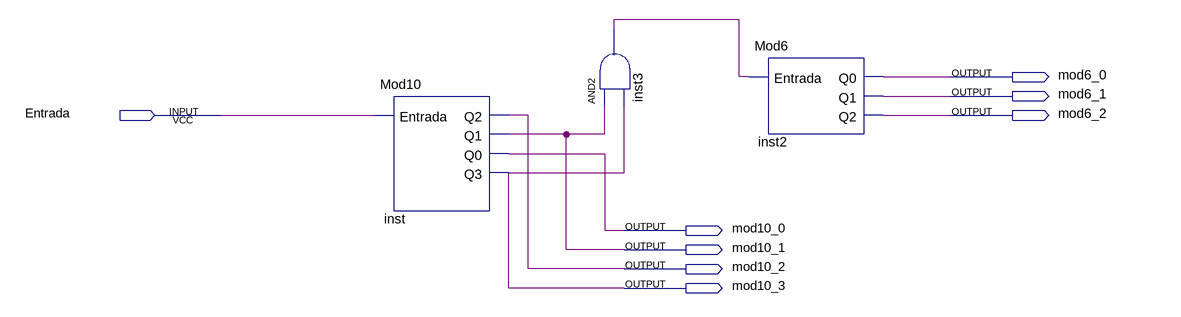
[diagram p0: schematic sheet]
// Quartus schematic mod60.bdf as structural Verilog: 3 symbols, 8 pins
module mod60 (
  input  Entrada,
  output mod6_0,
  output mod6_1,
  output mod6_2,
  output mod10_0,
  output mod10_1,
  output mod10_2,
  output mod10_3
);

  wire inst3_out;

  Mod10 inst (.Entrada(Entrada), .Q2(mod10_2), .Q1(mod10_1), .Q0(mod10_0), .Q3(mod10_3));
  and inst3 (inst3_out, mod10_1, mod10_3);
  Mod6 inst2 (.Entrada(inst3_out), .Q0(mod6_0), .Q1(mod6_1), .Q2(mod6_2));
endmodule
